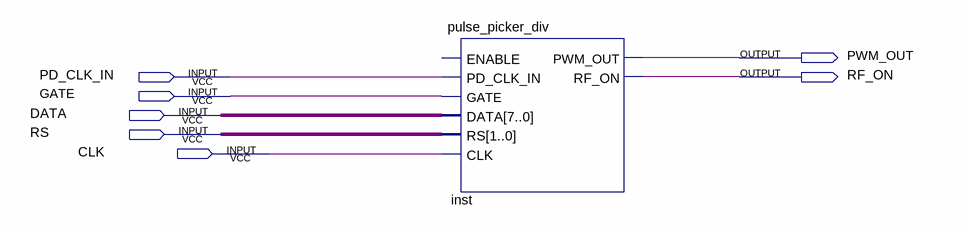
[diagram p0: schematic sheet]
// Quartus schematic pulse_picker.bdf as structural Verilog: 1 symbols, 7 pins
module pulse_picker (
  input  PD_CLK_IN,
  input  GATE,
  input  DATA,
  input  RS,
  input  CLK,
  output PWM_OUT,
  output RF_ON
);

  wire [1:0] undriven_2;
  wire [7:0] undriven;

  pulse_picker_div inst (
    .PD_CLK_IN(PD_CLK_IN), .GATE(GATE), .DATA(undriven), .RS(undriven_2), .CLK(CLK), .PWM_OUT(PWM_OUT),
    .RF_ON(RF_ON));  // open: ENABLE
endmodule
